# EAGLE board AK4493-Combi (EAGLE 9.6.2), part 1 of 2
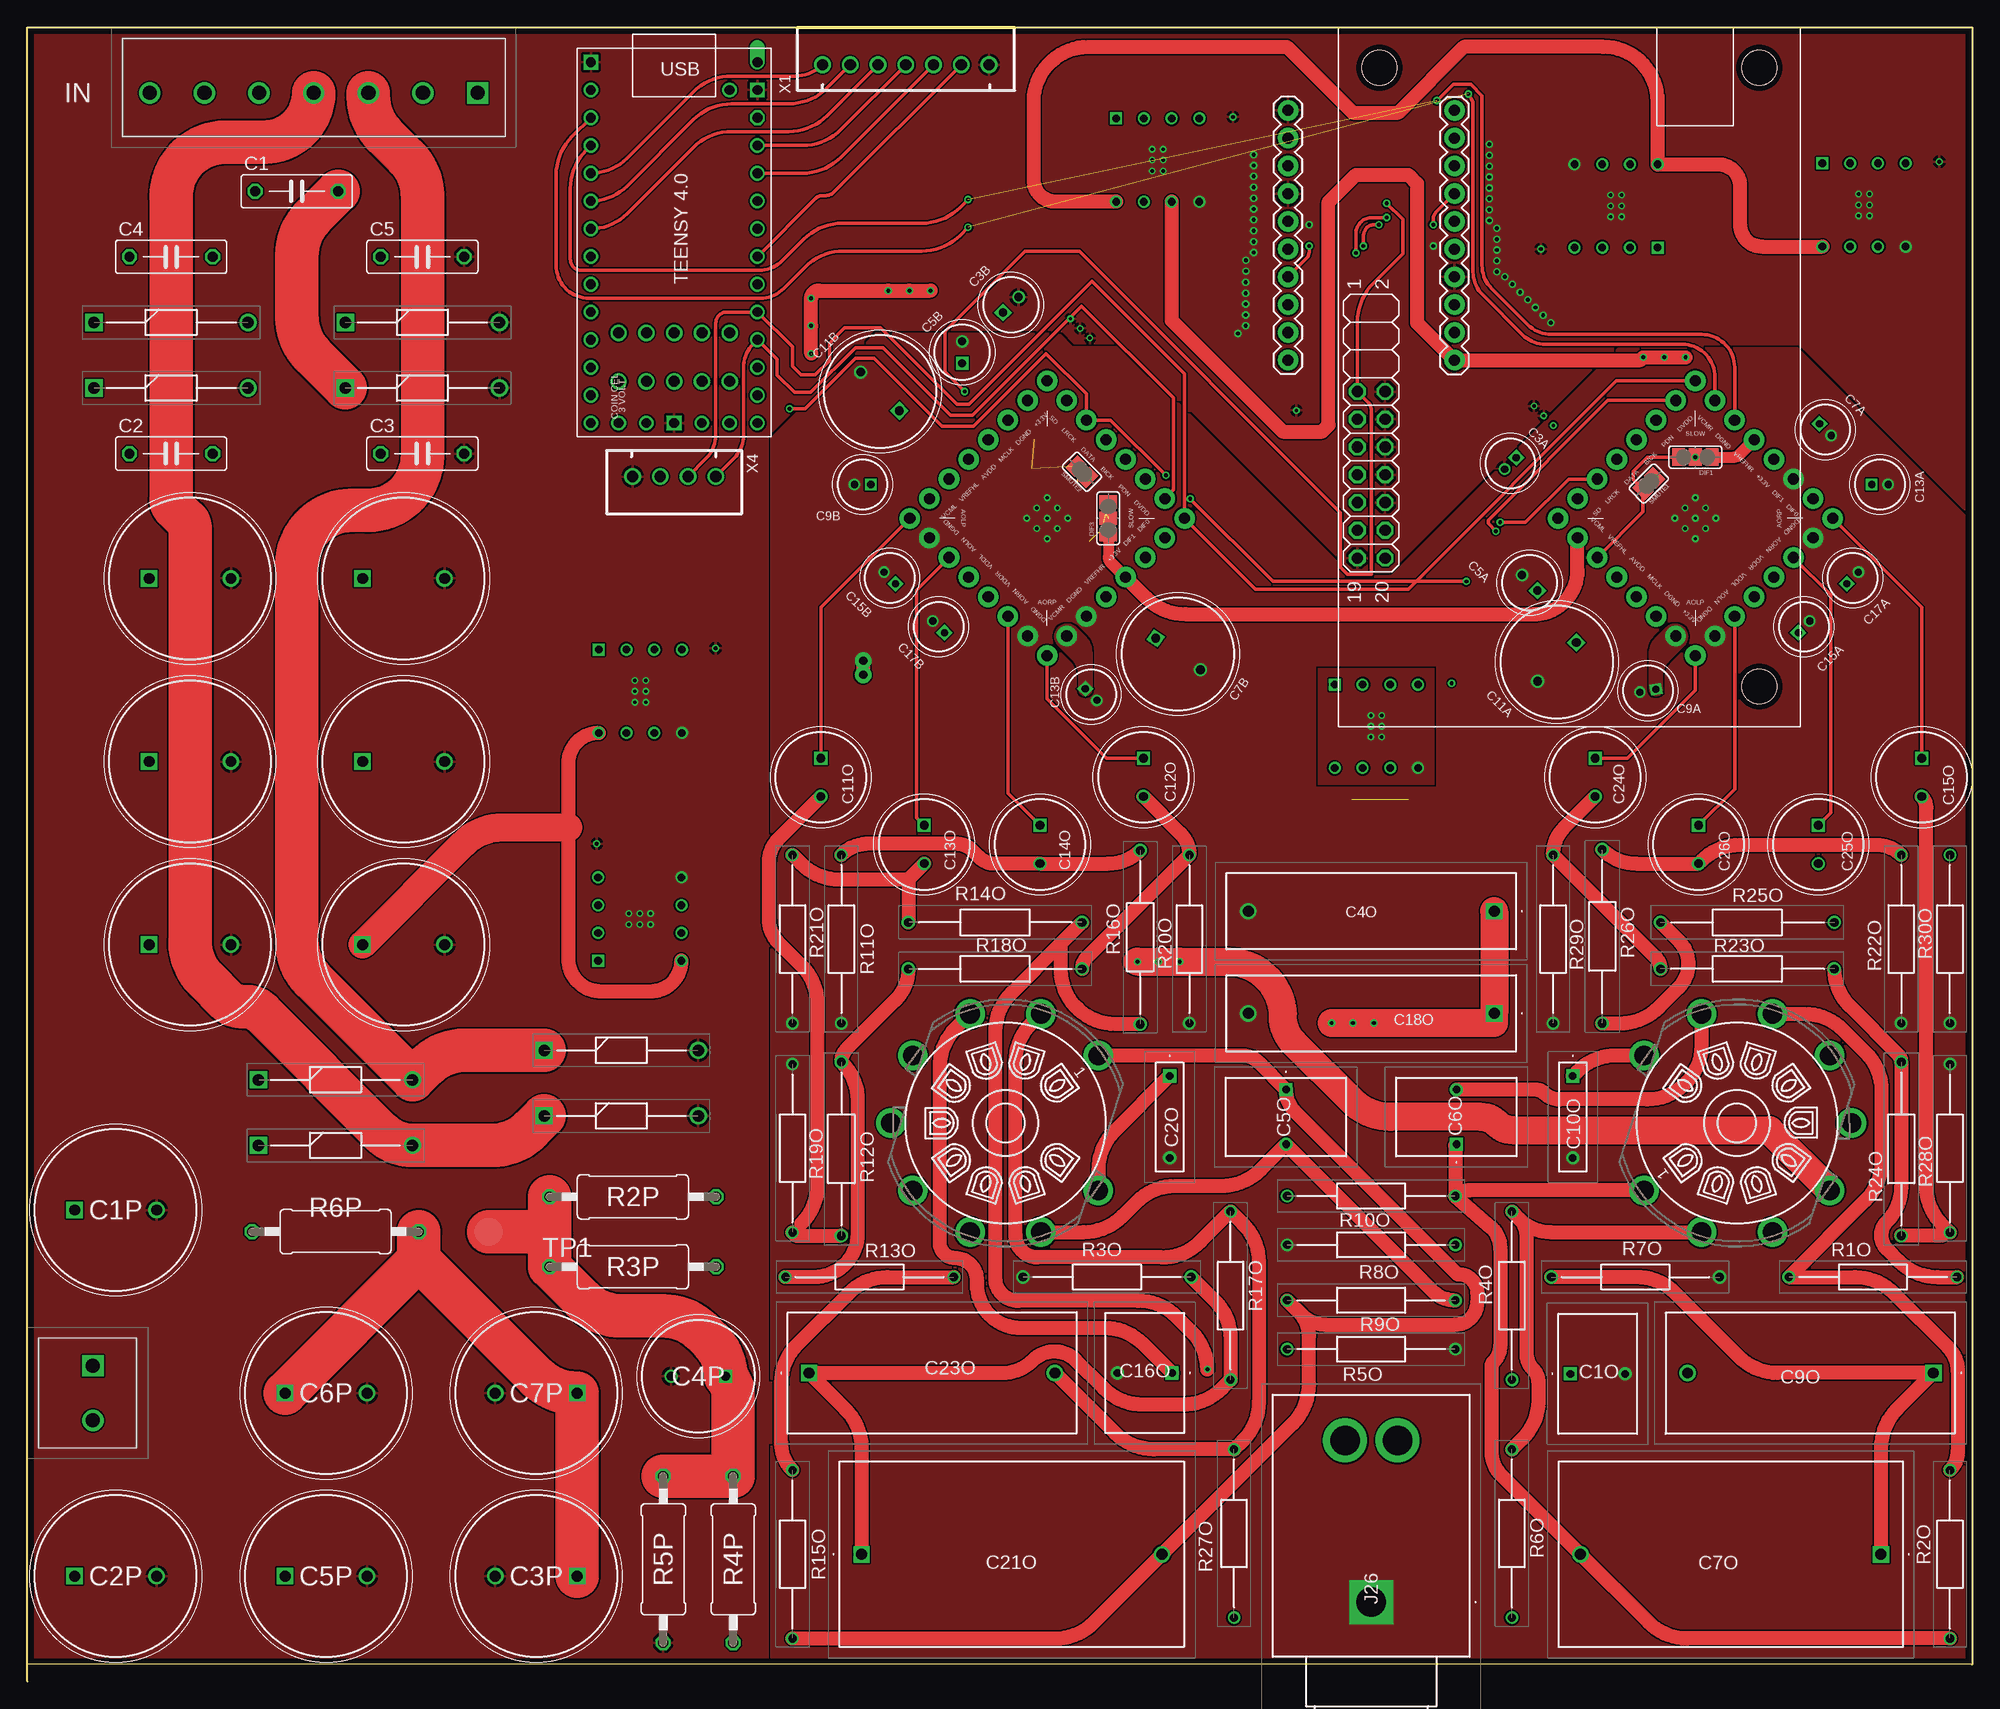
[diagram p5: board, top side]
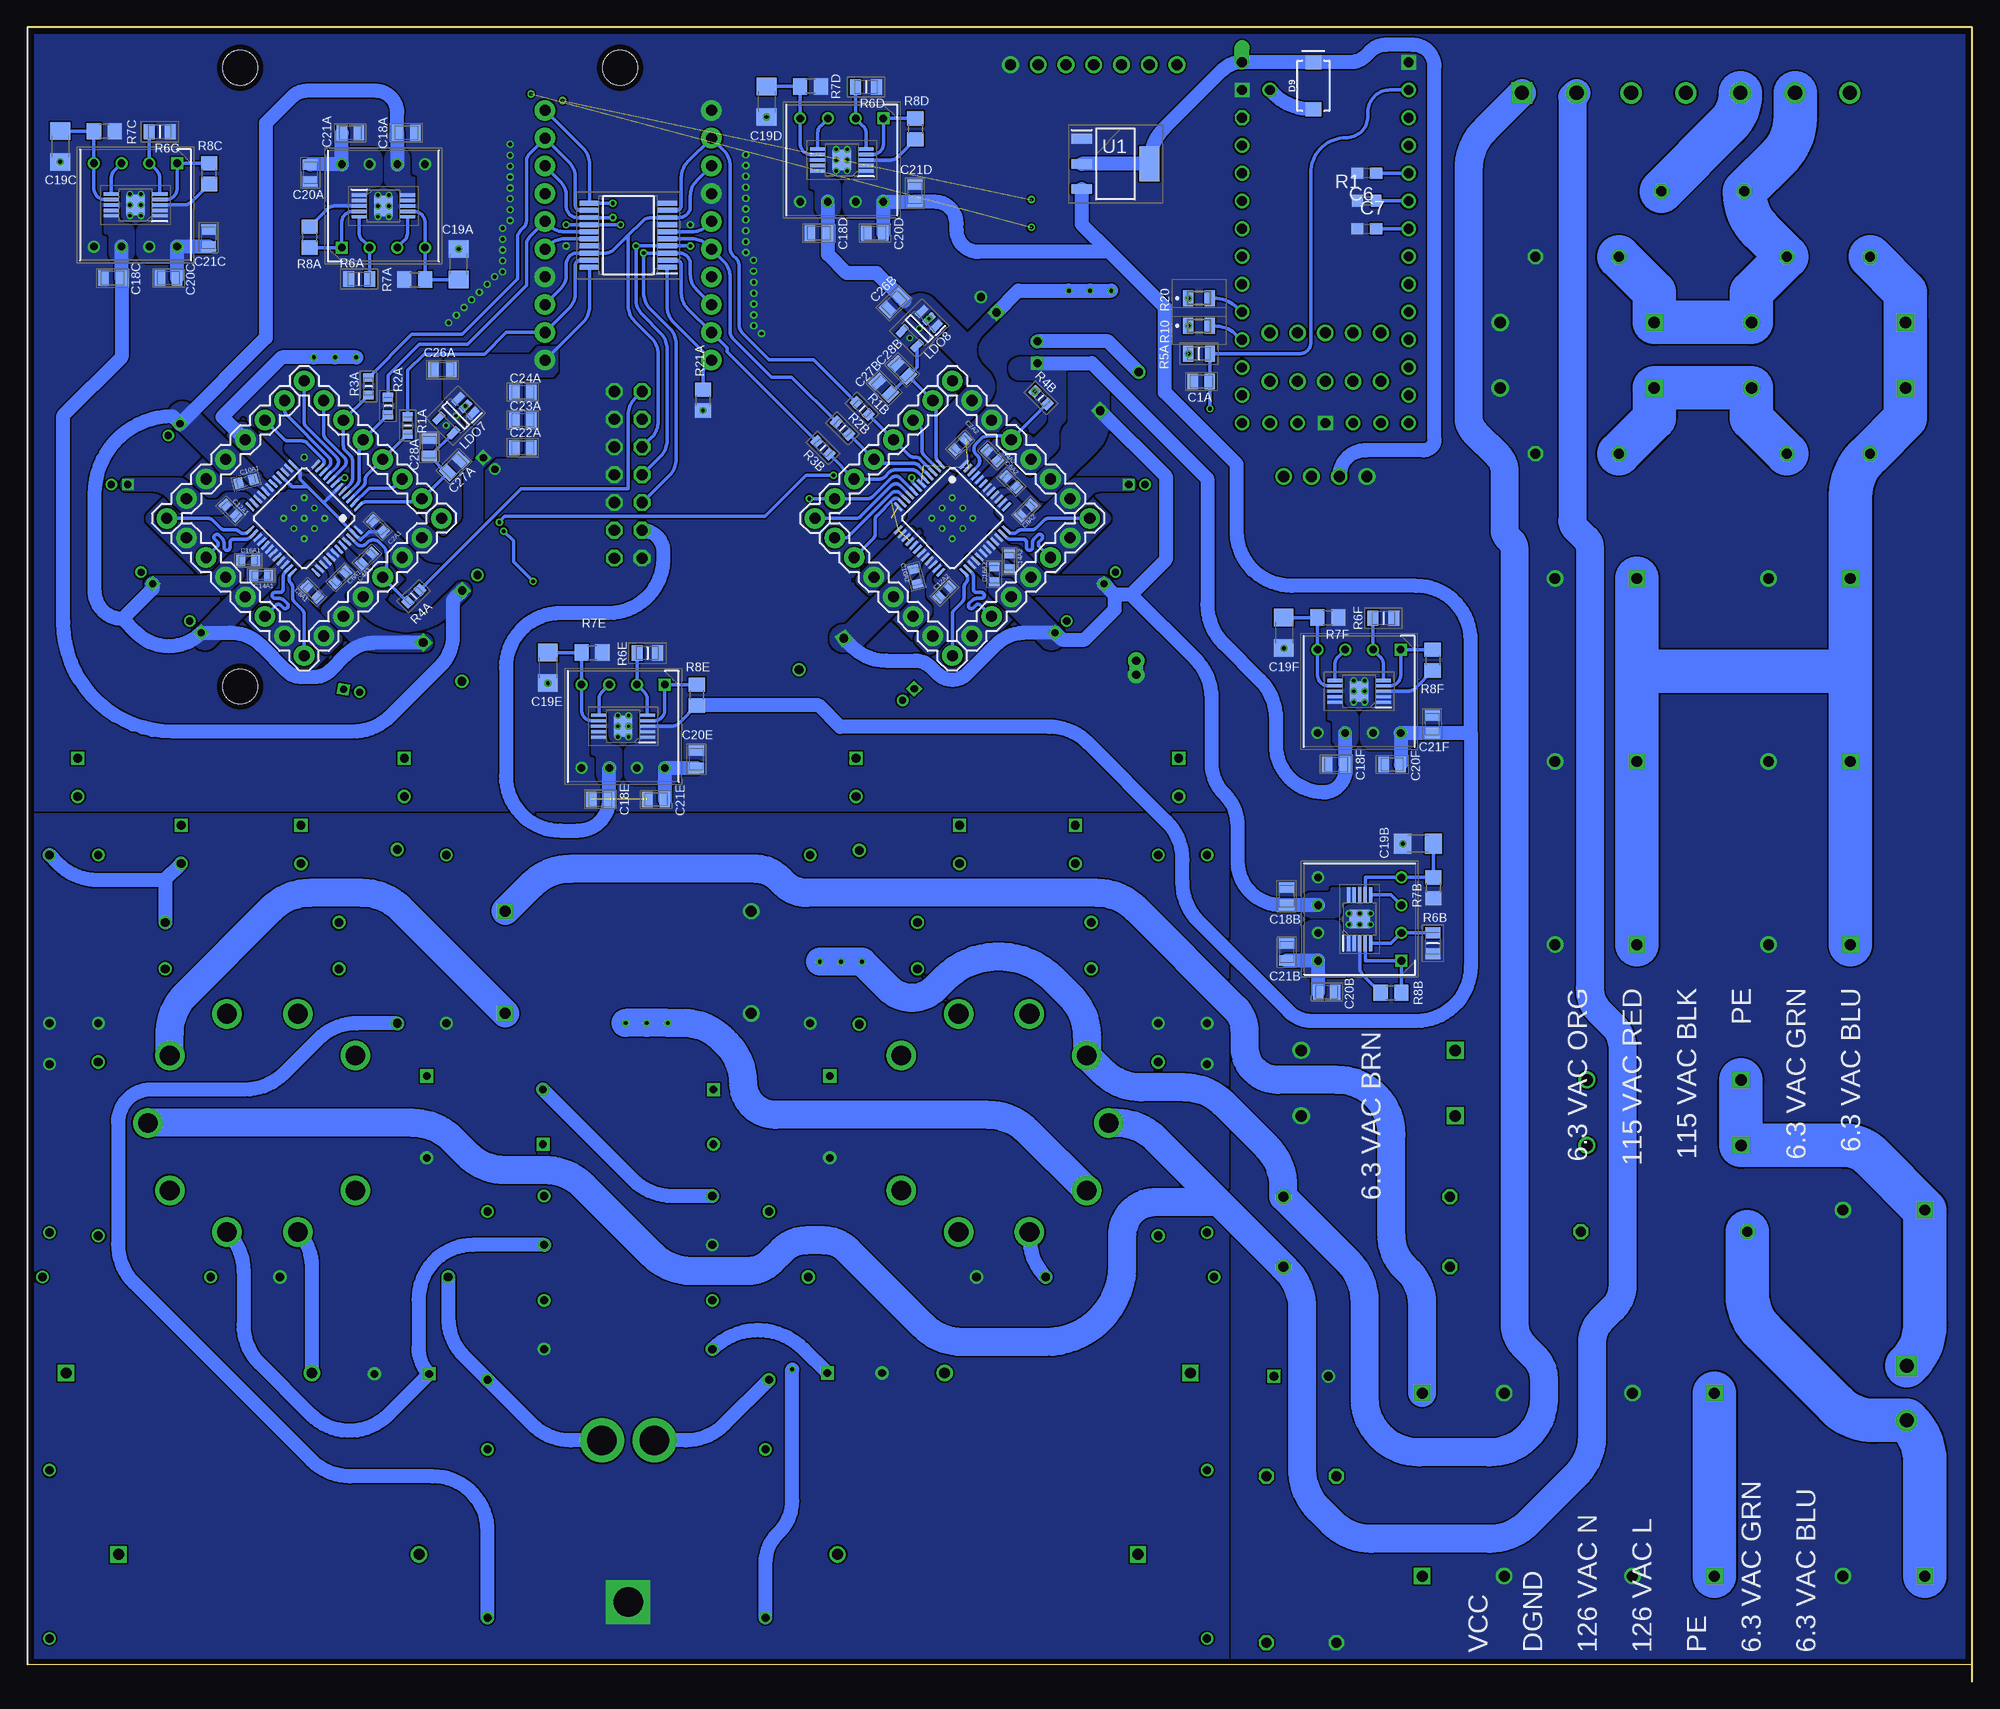
[diagram p6: board, bottom side, seen from below]

Size 178 x 151.34 mm. Coordinates in mm from the lower left corner, seen from the top.
Outline: 0,0 0,151.34 178,151.34 178,1.54 0,1.54
Copper layers (1*16): Top 0.035mm / dielectric 1.6mm / Bottom 0.035mm
Design rules "Elecrow_2-layer_PCB_eagle_rule": minimum track width 6mil, minimum drill 12mil, track to track 6mil, track to pad 6mil, pad to pad 6mil, via to via 8mil, smd to smd 0mil, copper to edge 20mil, drill to drill 10mil, minimum pad ring 6mil, minimum via ring 6mil, stop-mask expansion 0mil, vias tented up to drill 100mil, thermal gap 10mil
Net classes: 3 Power: width 1.27 mm, drill 1.27 mm, clearance 0.254 mm

## Footprints (pad centres in the part's own frame; a part is rotated, then mirrored left to right if it is on the bottom)
I2SOVERUSBV3 = drill 1.016 octagon: H3.7 33.322,1.745; H3.8 33.322,4.285; H3.9 35.862,1.745; H3.10 35.862,4.285; H3.11 38.403,1.745; H3.12 38.403,4.285; H3.13 40.943,1.745; H3.14 40.943,4.285; H3.15 43.483,1.745; H3.16 43.483,4.285; H3.17 46.023,1.745; H3.18 46.023,4.285; H3.19 48.562,1.745; H3.20 48.562,4.285 | hole 3.175: 3.688,3.775; 3.688,38.525; 60.312,38.525
C075-032X103 = drill 0.914 octagon: 1 -3.81,0; 2 3.81,0
CAPC2012X135N = smd 0.96 x 1.39: 1 -0.79,0; 2 0.79,0
MKP2C041001N00MN00 = drill 0.7 pad 1.2 square: 1 0,0 | drill 0.7 pad 1.2: 2 5,0
CAPPRD750W80D1475H4700 = drill 1 pad 1.5 square: 1 0,0 | drill 1 pad 1.5: 2 7.5,0
CAPC1608X95N = smd 0.81 x 0.99: 1 -0.69,0; 2 0.69,0
MKS4B031002A00JC00 = drill 0.7 pad 1.2 square: 1 0,0 | drill 0.7 pad 1.2: 2 7.5,0
CAPPRD150W45D450H600 = drill 0.65 pad 1.05 square: 1 0,0 | drill 0.65 pad 1.05: 2 1.5,0
CAPPRD200W55D500H800 = drill 0.75 pad 1.15 square: 1 0,0 | drill 0.75 pad 1.15: 2 2,0
MKP4G034705D00KSSD = drill 1 pad 1.5 square: 1 0,0 | drill 1 pad 1.5: 2 22.5,0
CAPPRD500W60D1025H1750 = drill 0.8 pad 1.2 square: 1 0,0 | drill 0.8 pad 1.2: 2 5,0
C0603 = smd 1.1 x 1: 1 -0.85,0; 2 0.85,0
CAPPRD500W60D1025H2150 = drill 0.8 pad 1.2 square: 1 0,0 | drill 0.8 pad 1.2: 2 5,0
DCP4G053006ID2KSSD = drill 1 pad 1.5 square: 1 0,0 | drill 1 pad 1.5: 2 27.5,0
MKP4G041005I00JSSD = drill 1 pad 1.5 square: 1 0,0 | drill 1 pad 1.5: 2 22.5,0
CAPPRD350W60D825H1300 = drill 0.8 pad 1.2 square: 1 0,0 | drill 0.8 pad 1.2: 2 3.5,0
CAPC2013X140N = smd 0.96 x 1.44: 1 -0.82,0; 2 0.82,0
C1206 = smd 1.6 x 1.8: 1 -1.4,0; 2 1.4,0 | drill 0.35: DGND 1.4,0
DIOAD1405W86L465D235 = drill 1.05 pad 1.575 square: 1 0,0 | drill 1.05 pad 1.575: 2 14.1,0
SMA-DIODE = smd 1.27 x 1.47: A -2.15,0; C 2.15,0
SJ_2 = smd 1.168 x 1.6: 1 -1.524,0; 2 0,0; 3 1.524,0
SOP50P490X110-11N = smd 1.425 x 0.3: 1 -2.212,1; 2 -2.212,0.5; 3 -2.212,0; 4 -2.212,-0.5; 5 -2.212,-1; 6 2.212,-1; 7 2.212,-0.5; 8 2.212,0; 9 2.212,0.5; 10 2.212,1 | smd 1.68 x 1.88: 11 0,0 | drill 0.305 pad 0.61: P$1 -0.498,0; P$2 0.498,0; P$3 -0.498,0.995; P$4 0.498,0.995; P$5 -0.498,-0.995; P$6 0.498,-0.995
LQFP48_ = smd 0.25 x 1: 1 -2.75,-4.25; 2 -2.25,-4.25; 3 -1.75,-4.25; 4 -1.25,-4.25; 5 -0.75,-4.25; 6 -0.25,-4.25; 7 0.25,-4.25; 8 0.75,-4.25; 9 1.25,-4.25; 10 1.75,-4.25; 11 2.25,-4.25; 12 2.75,-4.25; 25 2.75,4.25; 26 2.25,4.25; 27 1.75,4.25; 28 1.25,4.25; 29 0.75,4.25; 30 0.25,4.25; 31 -0.25,4.25; 32 -0.75,4.25; 33 -1.25,4.25; 34 -1.75,4.25; 35 -2.25,4.25; 36 -2.75,4.25 | smd 1 x 0.25: 13 4.25,-2.75; 14 4.25,-2.25; 15 4.25,-1.75; 16 4.25,-1.25; 17 4.25,-0.75; 18 4.25,-0.25; 19 4.25,0.25; 20 4.25,0.75; 21 4.25,1.25; 22 4.25,1.75; 23 4.25,2.25; 24 4.25,2.75; 37 -4.25,2.75; 38 -4.25,2.25; 39 -4.25,1.75; 40 -4.25,1.25; 41 -4.25,0.75; 42 -4.25,0.25; 43 -4.25,-0.25; 44 -4.25,-0.75; 45 -4.25,-1.25; 46 -4.25,-1.75; 47 -4.25,-2.25; 48 -4.25,-2.75 | drill 0.305 pad 0.61: P$1 0,0; P$2 -1.327,0; P$4 1.327,0; P$6 0,1.327; P$8 0,-1.327; P$10 -1.327,-1.327; P$17 1.327,-1.327; P$18 1.327,1.327; P$25 -1.327,1.327
SOP65P780X200-20N = smd 1.8 x 0.45: 1 -3.55,2.925; 2 -3.55,2.275; 3 -3.55,1.625; 4 -3.55,0.975; 5 -3.55,0.325; 6 -3.55,-0.325; 7 -3.55,-0.975; 8 -3.55,-1.625; 9 -3.55,-2.275; 10 -3.55,-2.925; 11 3.55,-2.925; 12 3.55,-2.275; 13 3.55,-1.625; 14 3.55,-0.975; 15 3.55,-0.325; 16 3.55,0.325; 17 3.55,0.975; 18 3.55,1.625; 19 3.55,2.275; 20 3.55,2.925
1935213 = drill 1.3 pad 1.95 square: 1 0,0 | drill 1.3 pad 1.95: 2 5,0; 3 10,0; 4 15,0; 5 20,0; 6 25,0; 7 30,0
1X07 = drill 1.016 pad 1.88: 1 0,0; 2 2.54,0; 3 5.08,0; 4 7.62,0; 5 10.16,0; 6 12.7,0; 7 15.24,0
DIPS762W51P254L1016H390Q8N = drill 0.7 pad 1.1 square: 1 0,0 | drill 0.7 pad 1.1: 2 0,-2.54; 3 0,-5.08; 4 0,-7.62; 5 7.62,-7.62; 6 7.62,-5.08; 7 7.62,-2.54; 8 7.62,0
1X10 = drill 1.016 pad 1.88: 1 0,0; 2 2.54,0; 3 5.08,0; 4 7.62,0; 5 10.16,0; 6 12.7,0; 7 15.24,0; 8 17.78,0; 9 20.32,0; 10 22.86,0
SJ63033A = drill 2.69 pad 4.035 square: 1 0,0 | drill 2.69 pad 4.035: 2 14.8,-2.4; 3 14.8,2.4
1935161 = drill 1.3 pad 1.95 square: 1 0,0 | drill 1.3 pad 1.95: 2 5,0
SOT95P280X145-5N = smd 1.2 x 0.6: 1 -1.25,0.95; 2 -1.25,0; 3 -1.25,-0.95; 4 1.25,-0.95; 5 1.25,0.95 | drill 0.305 pad 0.61: DGND -1.25,0; DGND2 0,0; DGND3 1.25,0
R0603 = smd 1 x 1.1: 1 -0.85,0; 2 0.85,0
RESC1608X55N = smd 0.8 x 0.95: 1 -0.8,0; 2 0.8,0
RESAD1540W55L620D230 = drill 0.75 pad 1.15: 1 0,0; 2 15.4,0
0411/15 = drill 0.914 octagon: 1 -7.62,0; 2 7.62,0
RESAD1540W60L620D230 = drill 0.8 pad 1.2: 1 0,0; 2 15.4,0
RESC2012X50N = smd 0.95 x 1.45: 1 -1,0; 2 1,0
RESC2012X60N = smd 1 x 1.4: 1 -0.95,0; 2 0.95,0
R0805 = smd 1.3 x 1.5: 1 -0.95,0; 2 0.95,0
RCS0805_E3 = smd 0.95 x 1.45: 1 -0.975,0; 2 0.975,0
RESAD1590W60L630D240 = drill 0.8 pad 1.2: 1 0,0; 2 15.9,0
R0805-POL = smd 1.3 x 1.5: 1 -0.95,0; 2 0.95,0 | drill 0.305 pad 0.61: DGND 0.95,0
SHORT_ALL-50 = drill 0.737 pad 1.524: 1 -0.635,0; 2 0.635,0
SJ = smd 1.168 x 1.6: 1 -0.762,0; 2 0.762,0
VT9-PT = drill 1.8 pad 2.4: 1 6.172,8.495; 2 0,10.5; 3 -6.172,8.495; 4 -9.986,3.245; 5 -9.986,-3.245; 6 -6.172,-8.495; 7 0,-10.5; 8 6.172,-8.495; 9 9.986,-3.244
B2,54 = smd 2.54 x 2.54: TP 0,0
SOT230P700X180-4N = smd 1.85 x 0.9: 1 -3.1,2.3; 2 -3.1,0; 3 -3.1,-2.3 | smd 1.85 x 3.2: 4 3.1,0
TEENSY40 = drill 0.9: 0-RX1 -13.97,-7.62; 1-TX1 -11.43,-7.62; 2-OUT2 -8.89,-7.62; 3-LRCLK2 -6.35,-7.62; 3V3-2 16.51,-2.54; 4-BCLK2 -3.81,-7.62; 5-IN2 -1.27,-7.62; 6-OUT1D 1.27,-7.62; 7-RX2/OUT1A 3.81,-7.62; 8-TX2/IN1 6.35,-7.62; 9-OUT1C 8.89,-7.62; 10-CS/MQSR 11.43,-7.62; 11-MOSI/CTX1 13.97,-7.62; 12-MIO/MQSL 16.51,-7.62; 13-SCK/CRX1/LED 16.51,7.62; 14-A0/TX3/S-PFI_OUT 13.97,7.62; 15-A1/RX3/S-PDIF_IN 11.43,7.62; 16-A2/RX4/SCL1 8.89,7.62; 17-A3/TX4/SDA1 6.35,7.62; 18-A4/SDA0 3.81,7.62; 19-A5/SCL0 1.27,7.62; 20-A6/TX5/LRCLK1 -1.27,7.62; 21-A7/RX5/BCLK1 -3.81,7.62; 22-A8/CTX1 -6.35,7.62; 23-A9/CRX1/CCLK1 -8.89,7.62; ON/OFF 16.51,5.08; PROGRAM 16.51,2.54; VBAT 16.51,-5.08; VUSB -13.97,5.08 | drill 0.9 octagon: 3V3-1 -11.43,7.62 | drill 1: 24-A10/TX6/SCL2 12.7,5.08; 25-A11/SDA2 8.255,5.08; 26-A12/MOSI1 12.7,2.54; 27-A13/SCK1 8.255,2.54; 28-RX7 12.7,0; 29-TX7 8.255,0; 30-CRX3 12.7,-2.54; 31-CTX3 8.255,-2.54; 32-OUTB1 12.7,-5.08; 33-MCLK2 8.255,-5.08 | drill 0.9 square: GND1 -16.51,-7.62; GND2 16.51,0; GND3 -13.97,7.62 | drill 0.9 offset: VIN -16.51,7.62
JST-XH-07-PACKAGE-ROUND-PAD = drill 1.016: 1 -7.62,0; 2 -5.08,0; 3 -2.54,0; 4 0,0; 5 2.54,0; 6 5.08,0; 7 7.62,0
JST-XH-04-PACKAGE-ROUND-PAD = drill 1.016: 1 -3.81,0; 2 -1.27,0; 3 1.27,0; 4 3.81,0

## Placement (x,y rotation side)
BD1  I2SOVERUSBV3  [I2SOVERUSBV3]  119.98,151.34 270 top
C1  [C075-032X103]  24.66,136.34 0 top
C1A  0.1uF, X7R  [CAPC2012X135N]  70.56,118.94 180 bottom
C1O  1uF/16V  [MKP2C041001N00MN00]  141.23,28.13 0 top
C1P  68u  [CAPPRD750W80D1475H4700]  4.33,43.12 0 top
C1P1  68u  [CAPPRD750W80D1475H4700]  11.14,100.91 0 top
C2  [C075-032X103]  13.16,112.34 0 top
C2A1  0.1u, Ceramic Capacitor X7R  [CAPC1608X95N]  145.92,105.68 315 bottom
C2A2  0.1u, Ceramic Capacitor X7R  [CAPC1608X95N]  92.61,113.15 45 bottom
C2O  0.1uF, 35V  [MKS4B031002A00JC00]  104.55,55.39 270 top
C2P  68u  [CAPPRD750W80D1475H4700]  4.33,9.62 0 top
C2P1  68u  [CAPPRD750W80D1475H4700]  30.68,100.91 0 top
C3  [C075-032X103]  36.16,112.34 0 top
C3A  80-A758BG106M1EAAE70  [CAPPRD150W45D450H600]  136.26,111.97 225 top
C3B  80-A758BG106M1EAAE70  [CAPPRD200W55D500H800]  89.31,125.24 45 top
C3P  68u  [CAPPRD750W80D1475H4700]  50.33,9.62 180 top
C3P1  68u  [CAPPRD750W80D1475H4700]  11.14,84.16 0 top
C4  [C075-032X103]  13.16,130.34 0 top
C4A1  0.1u, Ceramic Capacitor X7R  [CAPC1608X95N]  146.91,102.75 45 bottom
C4A2  0.1u, Ceramic Capacitor X7R  [CAPC1608X95N]  89.68,112.17 135 bottom
C4O  0.5uF/400V  [MKP4G034705D00KSSD]  134.25,70.46 180 top
C4P  UCY2E220MPD1TD  [CAPPRD500W60D1025H1750]  63.91,27.91 180 top
C5  [C075-032X103]  36.16,130.34 0 top
C5A  80-A758BG106M1EAAE70  [CAPPRD200W55D500H800]  138.21,99.8 135 top
C5B  80-A758BG106M1EAAE70  [CAPPRD200W55D500H800]  85.56,120.6 90 top
C5O  MKP2C041001N00MN00  [MKP2C041001N00MN00]  115.2,54.14 270 top
C5P  68u  [CAPPRD750W80D1475H4700]  23.58,9.62 0 top
C5P1  68u  [CAPPRD750W80D1475H4700]  30.68,84.16 0 top
C6  0.1 uF  [C0603]  55.4,137.99 180 bottom
C6A1  0.1u, Ceramic Capacitor X7R  [CAPC1608X95N]  149.35,101.02 225 bottom
C6A2  0.1u, Ceramic Capacitor X7R  [CAPC1608X95N]  87.94,109.72 315 bottom
C6O  MKP2C041001N00MN00  [MKP2C041001N00MN00]  130.8,49.14 90 top
C6P  68u  [CAPPRD750W80D1475H4700]  23.58,26.37 0 top
C6P1  68u  [CAPPRD750W80D1475H4700]  11.14,67.41 0 top
C7  0.1 uF  [C0603]  55.4,132.91 0 bottom
C7A  RNU1A100MDSASQ  [CAPPRD150W45D450H600]  164.03,115.05 315 top
C7B  APSG160ELL222MJ20S  [CAPPRD500W60D1025H2150]  103.27,95.43 325 top
C7O  30uF/400V  [DCP4G053006ID2KSSD]  169.65,11.61 180 top
C7P  68u  [CAPPRD750W80D1475H4700]  50.33,26.37 180 top
C7P1  68u  [CAPPRD750W80D1475H4700]  30.68,67.41 0 top
C8A1  0.1u, Ceramic Capacitor X7R  [CAPC1608X95N]  151.93,99.67 315 bottom
C8A2  0.1u, Ceramic Capacitor X7R  [CAPC1608X95N]  86.6,107.14 45 bottom
C9A  647-RNU1A100MDSASQ  [CAPPRD150W45D450H600]  149.06,90.77 190 top
C9B  647-RNU1A100MDSASQ  [CAPPRD150W45D450H600]  77.2,109.5 180 top
C9O  1uF/400V  [MKP4G041005I00JSSD]  174.45,28.21 180 top
C10A1  0.1u, Ceramic Capacitor X7R  [CAPC1608X95N]  157.99,109.79 195 bottom
C10A2  0.1u, Ceramic Capacitor X7R  [CAPC1608X95N]  96.72,101.09 285 bottom
C10O  0.1uF, 35V  [MKS4B031002A00JC00]  141.45,55.39 270 top
C11A  APSG160ELL222MJ20S  [CAPPRD500W60D1025H2150]  141.77,95.04 225 top
C11B  2200uF, 10V  [CAPPRD500W60D1025H2150]  79.81,116.25 135 top
C11O  100uF  [CAPPRD350W60D825H1300]  72.62,84.46 270 top
C12A1  0.1u, Ceramic Capacitor X7R  [CAPC1608X95N]  159.4,107.14 315 bottom
C12A2  0.1u, Ceramic Capacitor X7R  [CAPC1608X95N]  94.06,99.68 45 bottom
C12O  100uF  [CAPPRD350W60D825H1300]  102.15,84.46 270 top
C13A  647-RNU1A100MDSASQ  [CAPPRD150W45D450H600]  168.8,109.5 0 top
C13B  647-RNU1A100MDSASQ  [CAPPRD150W45D450H600]  96.83,90.82 315 top
C13O  100uF  [CAPPRD350W60D825H1300]  82.08,78.32 270 top
C14A1  0.1u, Ceramic Capacitor X7R  [CAPC1608X95N]  156.59,101.2 180 bottom
C14A2  0.1u, Ceramic Capacitor X7R  [CAPC1608X95N]  88.12,102.49 270 bottom
C14O  100uF  [CAPPRD350W60D825H1300]  92.69,78.32 270 top
C15A  647-RNU1A100MDSASQ  [CAPPRD150W45D450H600]  162.07,95.95 45 top
C15B  647-RNU1A100MDSASQ  [CAPPRD150W45D450H600]  79.47,100.42 135 top
C15O  100uF  [CAPPRD350W60D825H1300]  173.38,84.46 270 top
C16A1  0.1u, Ceramic Capacitor X7R  [CAPC1608X95N]  157.79,102.58 0 bottom
C16A2  0.1u, Ceramic Capacitor X7R  [CAPC1608X95N]  89.5,101.28 90 bottom
C16O  1uF/16V  [MKP2C041001N00MN00]  104.77,28.21 180 top
C17A  647-RNU1A100MDSASQ  [CAPPRD150W45D450H600]  166.53,100.42 45 top
C17B  647-RNU1A100MDSASQ  [CAPPRD150W45D450H600]  83.93,95.95 135 top
C18A  4.7u  [CAPC2013X140N]  143.32,141.69 0 bottom
C18B  4.7u  [CAPC2013X140N]  62.75,71.83 90 bottom
C18C  4.7u  [CAPC2013X140N]  170.19,128.39 180 bottom
C18D  4.7u  [CAPC2013X140N]  105.55,132.5 180 bottom
C18E  4.7u  [CAPC2013X140N]  125.56,80.69 180 bottom
C18F  4.7u  [CAPC2013X140N]  58.2,83.89 180 bottom
C18O  0.5uF/400V  [MKP4G034705D00KSSD]  134.25,61.1 180 top
C19A  22u  [C1206]  138.52,129.65 90 bottom
C19B  22u  [C1206]  50.71,76.64 180 bottom
C19C  22u  [C1206]  174.99,140.43 270 bottom
C19D  22u  [C1206]  110.35,144.53 270 bottom
C19E  22u  [C1206]  130.36,92.72 270 bottom
C19F  22u  [C1206]  63,95.92 270 bottom
C20A  10u  [CAPC2012X135N]  152.1,138.01 270 bottom
C20B  10u  [CAPC2012X135N]  59.07,63.05 0 bottom
C20C  10u  [CAPC2012X135N]  165.08,128.39 180 bottom
C20D  10u  [CAPC2012X135N]  100.44,132.5 180 bottom
C20E  10u  [CAPC2012X135N]  116.78,84.36 90 bottom
C20F  10u  [CAPC2012X135N]  53.09,83.89 180 bottom
C21A  0.1u  [CAPC2012X135N]  148.43,141.69 0 bottom
C21B  0.1u  [CAPC2012X135N]  62.75,66.72 90 bottom
C21C  0.1u  [CAPC2012X135N]  161.41,132.07 90 bottom
C21D  0.1u  [CAPC2012X135N]  96.76,136.17 90 bottom
C21E  0.1u  [CAPC2012X135N]  120.45,80.69 180 bottom
C21F  0.1u  [CAPC2012X135N]  49.41,87.56 90 bottom
C21O  30uF/400V  [DCP4G053006ID2KSSD]  76.35,11.61 0 top
C22A  0.1u, Ceramic Capacitor X7R  [CAPC2012X135N]  132.65,112.87 0 bottom
C23A  0.1u, Ceramic Capacitor X7R  [CAPC2012X135N]  132.65,115.41 0 bottom
C23O  1uF/400V  [MKP4G041005I00JSSD]  71.55,28.21 0 top
C24A  0.1u, Ceramic Capacitor X7R  [CAPC2012X135N]  132.65,117.95 0 bottom
C24O  100uF  [CAPPRD350W60D825H1300]  143.5,84.46 270 top
C25O  100uF  [CAPPRD350W60D825H1300]  163.92,78.32 270 top
C26A  4.7u, Ceramic Capacitor X7R  [CAPC2013X140N]  140.02,120.02 180 bottom
C26B  4.7u, Ceramic Capacitor X7R  [CAPC2013X140N]  98.68,126.09 225 bottom
C26O  100uF  [CAPPRD350W60D825H1300]  152.96,78.32 270 top
C27A  4.7u, Ceramic Capacitor X7R  [CAPC2013X140N]  138.92,111.17 45 bottom
C27B  4.7u, Ceramic Capacitor X7R  [CAPC2013X140N]  99.6,118.35 135 bottom
C28A  0.1u, Ceramic Capacitor X7R  [CAPC2012X135N]  141.2,112.91 90 bottom
C28B  0.1u, Ceramic Capacitor X7R  [CAPC2012X135N]  97.93,119.99 135 bottom
D1  1N4007FFG  [DIOAD1405W86L465D235]  47.31,51.74 0 top
D2  1N4007FFG  [DIOAD1405W86L465D235]  47.31,57.74 0 top
D3  1N4007FFG  [DIOAD1405W86L465D235]  21.16,55.04 0 top
D4  1N4007FFG  [DIOAD1405W86L465D235]  21.16,49.04 0 top
D5  1N4007FFG  [DIOAD1405W86L465D235]  29.11,124.34 0 top
D6  1N4007FFG  [DIOAD1405W86L465D235]  29.11,118.34 0 top
D7  1N4007FFG  [DIOAD1405W86L465D235]  6.11,118.34 0 top
D8  1N4007FFG  [DIOAD1405W86L465D235]  6.11,124.34 0 top
D9  1A/40V/500mV  [SMA-DIODE]  60.3,146 90 bottom
DIF1  [SJ_2]  152.66,112.01 0 top
DIF3  [SJ_2]  98.93,106.41 270 top
IC1  LT3042  [SOP50P490X110-11N]  145.41,134.99 0 bottom
IC2  AK4493  [LQFP48_]  152.66,106.41 135 bottom
IC3  AK4493  [LQFP48_]  93.34,106.41 225 bottom
IC4  LT3042  [SOP50P490X110-11N]  168.1,135.09 180 bottom
IC4A  SN74ABT273DBR  [SOP65P780X200-20N]  123,132.31 180 bottom
IC5  LT3042  [SOP50P490X110-11N]  56.05,69.74 90 bottom
IC6  LT3042  [SOP50P490X110-11N]  103.46,139.19 180 bottom
IC7  LT3042  [SOP50P490X110-11N]  56.11,90.58 180 bottom
IC8  LT3042  [SOP50P490X110-11N]  123.47,87.38 180 bottom
IN  1935213  [1935213]  41.21,145.34 180 top
J5  [1X07]  165.23,106.41 45 bottom
J6  [1X07]  152.66,93.84 135 bottom
J7  [1X07]  140.09,106.41 225 bottom
J8  [1X07]  152.66,118.99 315 bottom
J9  [1X07]  93.34,93.84 135 bottom
J10  [1X07]  80.77,106.41 225 bottom
J11  [1X07]  93.34,118.99 315 bottom
J12  [1X07]  105.91,106.41 45 bottom
J15  XR2A-0811-N  [DIPS762W51P254L1016H390Q8N]  149.22,131.18 90 bottom
J16  XR2A-0811-N  [DIPS762W51P254L1016H390Q8N]  164.29,138.9 270 bottom
J17  XR2A-0811-N  [DIPS762W51P254L1016H390Q8N]  52.24,65.93 180 bottom
J18  XR2A-0811-N  [DIPS762W51P254L1016H390Q8N]  99.65,143 270 bottom
J19  XR2A-0811-N  [DIPS762W51P254L1016H390Q8N]  52.3,94.39 270 bottom
J20  XR2A-0811-N  [DIPS762W51P254L1016H390Q8N]  119.66,91.19 270 bottom
J21  [1X10]  115.38,143.74 270 top
J22  [1X10]  130.62,120.88 90 top
J26  SJ-63033A  [SJ63033A]  123,7.24 90 top
J27  1935161  [1935161]  6,28.87 270 top
LDO7  LP5907-1.8V  [SOT95P280X145-5N]  138.78,115.8 225 bottom
LDO8  LP5907-1.8V  [SOT95P280X145-5N]  96.36,123.78 225 bottom
R1  5k  [R0603]  55.4,135.45 0 bottom
R1A  RT0603DRE075R1L  [RESC1608X55N]  143.19,114.89 270 bottom
R1B  RT0603DRE075R1L  [RESC1608X55N]  101.58,116.45 315 bottom
R1O  47kOhm  [RESAD1540W55L620D230]  176.62,36.99 180 top
R2A  RT0603DRE075R1L  [RESC1608X55N]  144.98,116.69 270 bottom
R2B  RT0603DRE075R1L  [RESC1608X55N]  103.38,114.66 315 bottom
R2O  47kOhm  [RESAD1540W55L620D230]  175.97,3.91 90 top
R2P  220  [0411/15]  55.42,44.33 0 top
R3A  RT0603DRE075R1L  [RESC1608X55N]  146.78,118.48 270 bottom
R3B  RT0603DRE075R1L  [RESC1608X55N]  105.17,112.86 315 bottom
R3O  1M*  [RESAD1540W60L620D230]  106.53,36.99 180 top
R3P  220  [0411/15]  55.42,37.93 180 top
R4A  RT0603DRE075R1L  [RESC1608X55N]  142.62,99.3 225 bottom
R4B  RT0603DRE075R1L  [RESC1608X55N]  85.22,117.45 315 bottom
R4O  47kOhm  [RESAD1540W55L620D230]  135.88,27.59 90 top
R4P  300k  [0411/15]  64.61,11.16 270 top
R5A  10K, Resistor 1%  [RESC2012X50N]  70.77,121.48 180 bottom
R5O  150*  [RESAD1540W55L620D230]  130.7,30.39 180 top
R5P  100k  [0411/15]  58.21,11.16 90 top
R6A  1k  [RESC2012X60N]  147.63,128.3 180 bottom
R6B  1k  [RESC2012X60N]  49.36,67.52 270 bottom
R6C  1k  [RESC2012X60N]  165.88,141.78 0 bottom
R6D  1k  [RESC2012X60N]  101.24,145.88 0 bottom
R6E  1k  [RESC2012X60N]  121.25,94.07 0 bottom
R6F  1k  [RESC2012X60N]  53.89,97.27 0 bottom
R6O  47kOhm  [RESAD1540W55L620D230]  135.88,5.83 90 top
R6P  330  [0411/15]  28.21,41.15 180 top
R7A  33k  [R0805]  142.55,128.25 180 bottom
R7B  33k  [R0805]  49.31,72.6 270 bottom
R7C  33k  [R0805]  170.96,141.83 0 bottom
R7D  33k  [R0805]  106.32,145.93 0 bottom
R7E  33k  [R0805]  126.33,94.12 0 bottom
R7F  33k  [R0805]  58.97,97.32 0 bottom
R7O  1M*  [RESAD1540W60L620D230]  139.47,36.99 0 top
R8A  200k  [R0805]  152.15,132.13 270 bottom
R8B  200k  [R0805]  53.19,63 0 bottom
R8C  200k  [R0805]  161.36,137.95 90 bottom
R8D  200k  [R0805]  96.71,142.05 90 bottom
R8E  200k  [R0805]  116.73,90.24 90 bottom
R8F  200k  [R0805]  49.36,93.44 90 bottom
R8O  150*  [RESAD1540W55L620D230]  115.3,39.93 0 top
R9O  150*  [RESAD1540W55L620D230]  115.3,34.86 0 top
R10  2.2k, 1%  [RCS0805_E3]  70.77,124.02 0 bottom
R10O  150*  [RESAD1540W55L620D230]  130.7,44.4 180 top
R11O  10k  [RESAD1540W55L620D230]  74.5,75.61 270 top
R12O  182  [RESAD1590W60L630D240]  74.5,56.67 270 top
R13O  47kOhm  [RESAD1540W55L620D230]  69.38,36.99 0 top
R14O  182  [RESAD1590W60L630D240]  96.53,69.44 180 top
R15O  47kOhm  [RESAD1540W55L620D230]  70.03,3.91 90 top
R16O  182  [RESAD1590W60L630D240]  101.86,60.12 90 top
R17O  47kOhm  [RESAD1540W55L620D230]  110.12,27.59 90 top
R18O  182  [RESAD1590W60L630D240]  80.63,65.18 0 top
R19O  10k  [RESAD1540W55L620D230]  70.03,56.47 270 top
R20  2.2k, 1%  [RCS0805_E3]  70.77,126.56 0 bottom
R20O  10k  [RESAD1540W55L620D230]  106.35,75.61 270 top
R21A  Not Pop.  [R0805-POL]  116.15,117.23 270 bottom
R21O  10k  [RESAD1540W55L620D230]  70.03,60.21 90 top
R22O  10k  [RESAD1540W55L620D230]  171.5,75.61 270 top
R23O  182  [RESAD1590W60L630D240]  165.37,65.18 180 top
R24O  182  [RESAD1590W60L630D240]  171.5,56.67 270 top
R25O  182  [RESAD1590W60L630D240]  149.47,69.44 0 top
R26O  182  [RESAD1590W60L630D240]  144.14,60.21 90 top
R27O  47kOhm  [RESAD1540W55L620D230]  110.45,5.83 90 top
R28O  10k  [RESAD1540W55L620D230]  175.97,56.47 270 top
R29O  10k  [RESAD1540W55L620D230]  139.65,75.61 270 top
R30O  10k  [RESAD1540W55L620D230]  175.97,60.21 90 top
SH3  SHORTA5  [SHORT_ALL-50]  76.51,92.74 90 top
SMUTE1  [SJ]  148.41,109.59 225 top
SMUTE2  [SJ]  96.51,110.67 135 top
SX1  VT9-PT  [VT9-PT]  89.53,51.08 342 top
SX2  VT9-PT  [VT9-PT]  156.47,51.08 162 top
TP1  TPB2,54  [B2,54]  42.2,41.13 90 top
U1  AZ1117H-5.0TRE1  [SOT230P700X180-4N]  78.4,138.84 0 bottom
U$1  TEENSY40  [TEENSY40]  59.2,131.64 270 top
X1  JST-XH-07-PIN-ROUND-PAD  [JST-XH-07-PACKAGE-ROUND-PAD]  80.4,147.91 0 top
X4  JST-XH-04-PIN-ROUND-PAD  [JST-XH-04-PACKAGE-ROUND-PAD]  59.2,110.24 180 top